# EAGLE design e-208 bms master v2 (EAGLE 6.6.0)
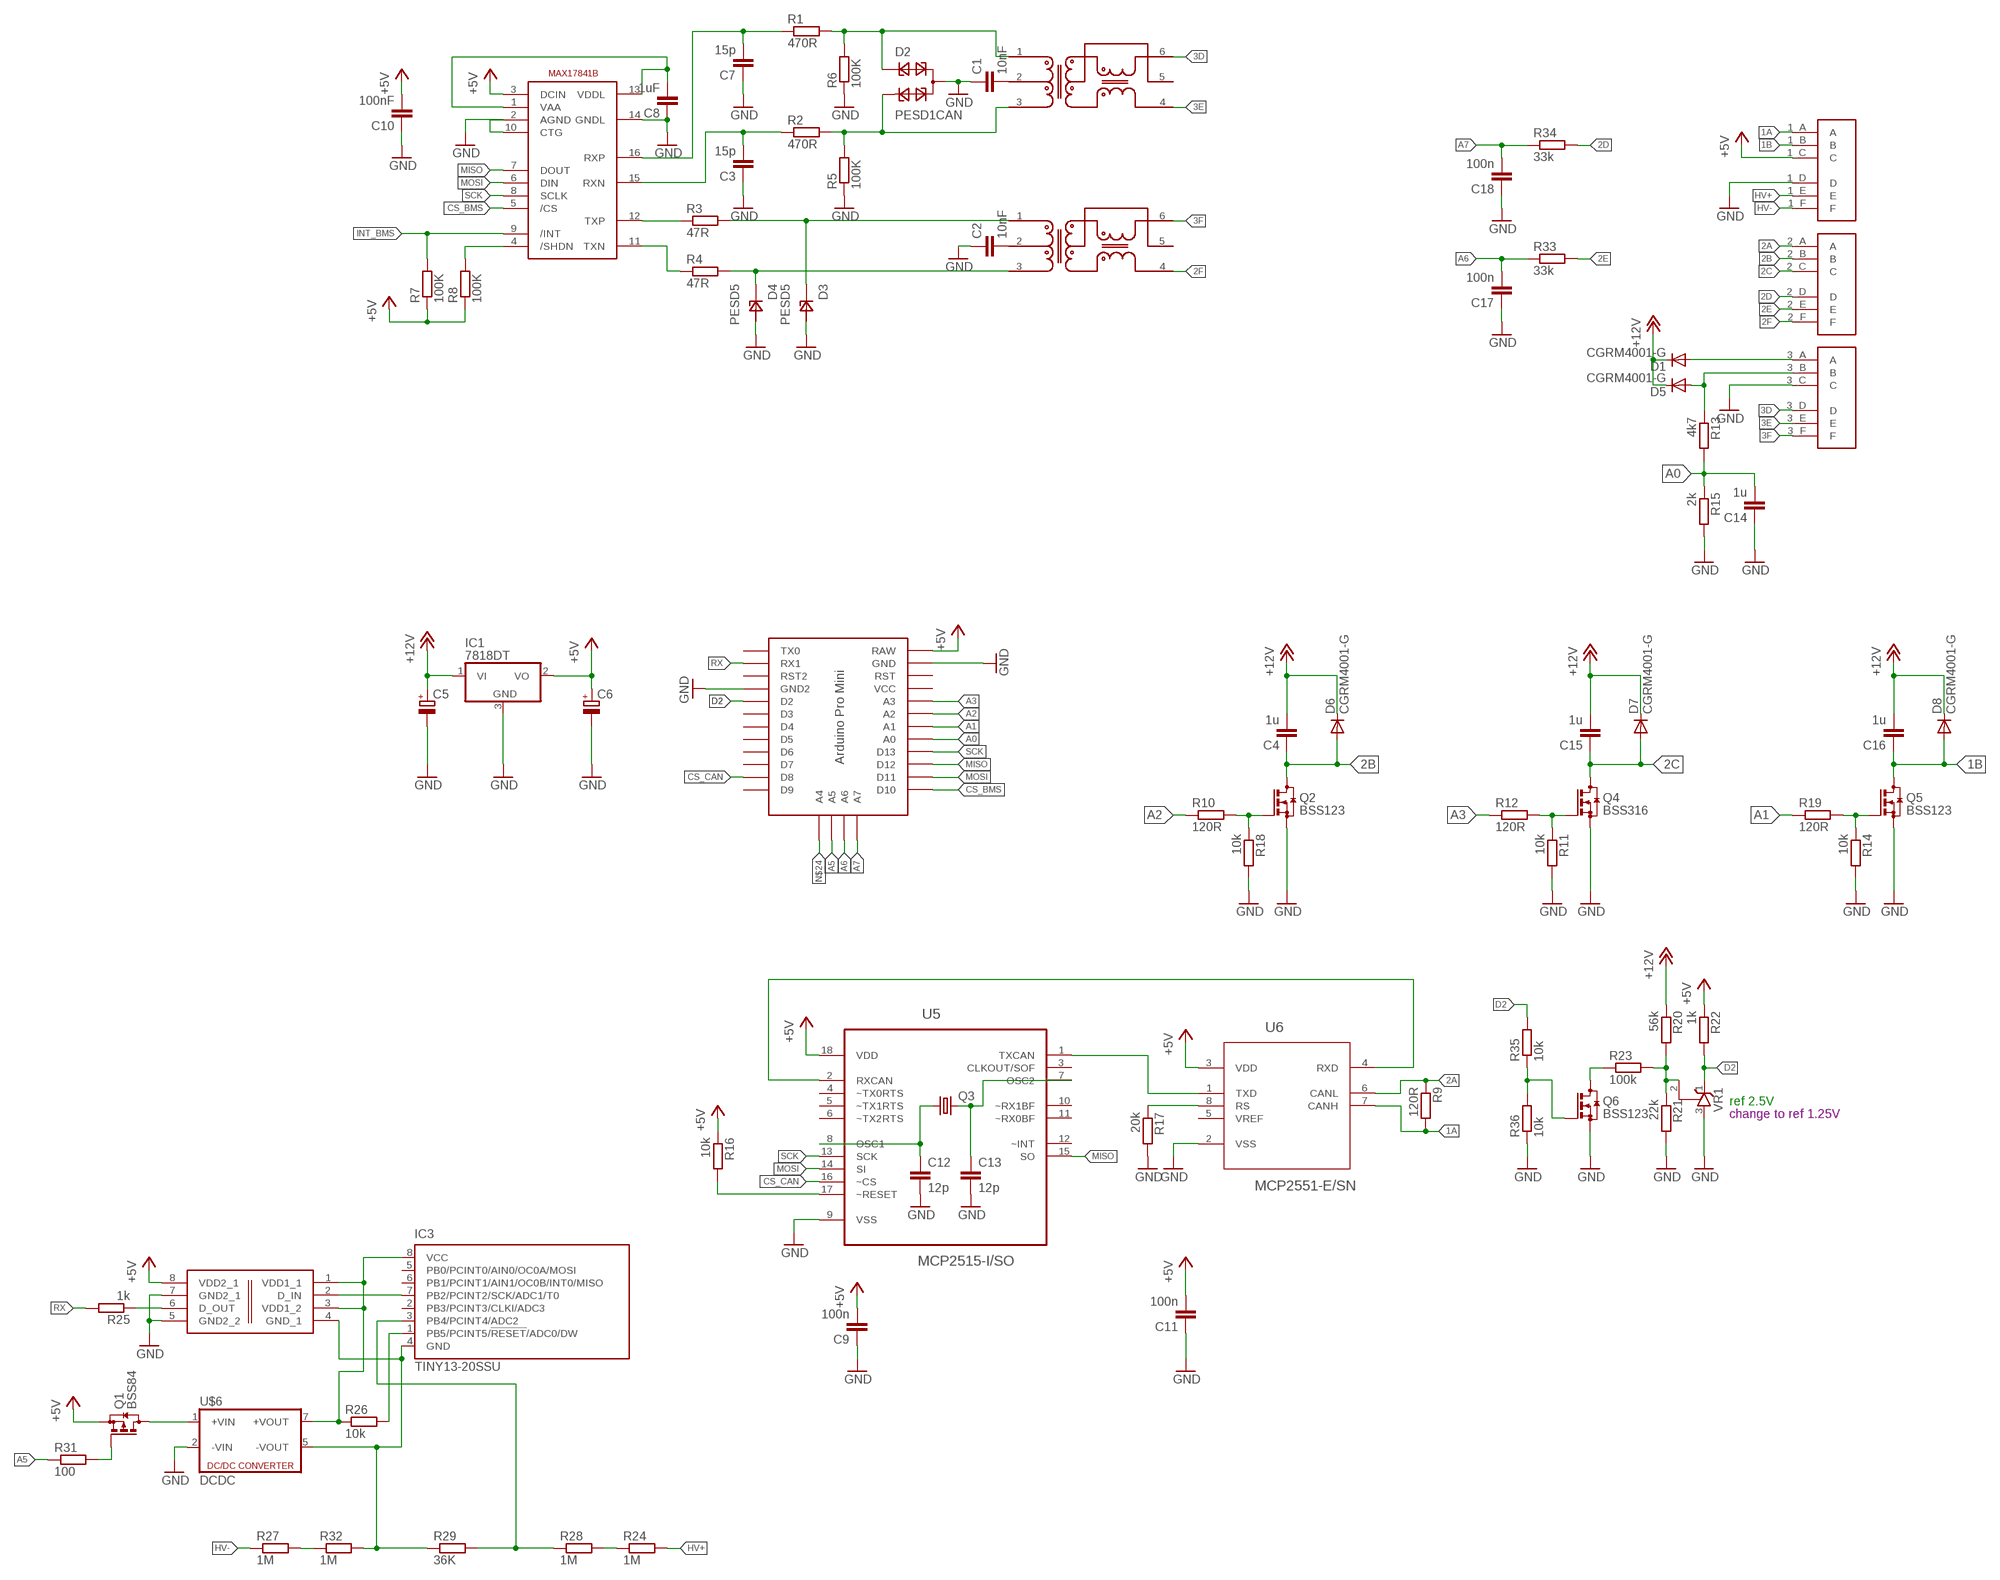
[diagram p0: schematic, sheet 1]

## Parts
C1  10nF  C-EUC0805  [C0805]
C2  10nF  C-EUC0805  [C0805]
C3  15p  C-EUC0805  [C0805]
C4  1u  C-EUC0805  [C0805]
C5  CPOL-EU153CLV-1010  [153CLV-1010]
C6  CPOL-EU153CLV-1010  [153CLV-1010]
C7  15p  C-EUC0805  [C0805]
C8  1uF  C-EUC0805  [C0805]
C9  100n  C-EUC0805  [C0805]
C10  100nF  C-EUC0805  [C0805]
C11  100n  C-EUC0805  [C0805]
C12  12p  C-EUC0603  [C0603]
C13  12p  C-EUC0603  [C0603]
C14  1u  C-EUC0805  [C0805]
C15  1u  C-EUC0805  [C0805]
C16  1u  C-EUC0805  [C0805]
C17  100n  C-EUC0805  [C0805]
C18  100n  C-EUC0805  [C0805]
D1  CGRM4001-G  [SOD-123_MINI-SMA]
D2  PESD1CAN  [SOT23]
D3  PESD5  [SOD323]
D4  PESD5  [SOD323]
D5  CGRM4001-G  [SOD-123_MINI-SMA]
D6  CGRM4001-G  [SOD-123_MINI-SMA]
D7  CGRM4001-G  [SOD-123_MINI-SMA]
D8  CGRM4001-G  [SOD-123_MINI-SMA]
IC1  7818DT  [TO252]
IC3  TINY13-20SSU  [8S1]
Q1  BSS84  [SOT23]
Q2  BSS123  [SOT23]
Q3  CRYSTALHC49U-V  [HC49U-V]
Q4  BSS316  BSS123  [SOT23]
Q5  BSS123  [SOT23]
Q6  BSS123  [SOT23]
R1  470R  R-EU_R0805  [R0805]
R2  470R  R-EU_R0805  [R0805]
R3  47R  R-EU_R0805  [R0805]
R4  47R  R-EU_R0805  [R0805]
R5  100K  R-EU_R0805  [R0805]
R6  100K  R-EU_R0805  [R0805]
R7  100K  R-EU_R0805  [R0805]
R8  100K  R-EU_R0805  [R0805]
R9  120R  R-EU_R0805  [R0805]
R10  120R  R-EU_R0805  [R0805]
R11  10k  R-EU_R0805  [R0805]
R12  120R  R-EU_R0805  [R0805]
R13  4k7  R-EU_R0805  [R0805]
R14  10k  R-EU_R0805  [R0805]
R15  2k  R-EU_R0805  [R0805]
R16  10k  R-EU_R0805  [R0805]
R17  20k  R-EU_R0805  [R0805]
R18  10k  R-EU_R0805  [R0805]
R19  120R  R-EU_R0805  [R0805]
R20  56k  R-EU_R0805  [R0805]
R21  22k  R-EU_R0805  [R0805]
R22  1k  R-EU_R0805  [R0805]
R23  100k  R-EU_R0805  [R0805]
R24  1M  R-EU_R0805  [R0805]
R25  1k  R-EU_R0805  [R0805]
R26  10k  R-EU_R0805  [R0805]
R27  1M  R-EU_R0805  [R0805]
R28  1M  R-EU_R0805  [R0805]
R29  36K  R-EU_R0805  [R0805]
R31  100  R-EU_R0805  [R0805]
R32  1M  R-EU_R0805  [R0805]
R33  33k  R-EU_R0805  [R0805]
R34  33k  R-EU_R0805  [R0805]
R35  10k  R-EU_R0805  [R0805]
R36  10k  R-EU_R0805  [R0805]
U2  MAX17841B  [TSSOP16]
U5  MCP2515-I/SO  [SOIC127P1034X264-18N]
U6  MCP2551-E/SN  [SOIC127P600X175-8N]
U$1  18P_ME  [18P_ME]
U$2  PRO-MINI-3  [PRO-MINI-3]
U$3  SM91502ALE  [SM91502ALE]
U$4  SM91502ALE  [SM91502ALE]
U$5  ADUM110N  [SOIC8]
U$6  DCDC  [DCDC]
VR1  TL431CLPSOT23  [SOT23]

## Nets
1A: R9.2 U6.7(CANH) U$1.1_A(A)
1B: C16.1 D8.A Q5.3(D) U$1.1_B(B)
2A: R9.1 U6.6(CANL) U$1.2_A(A)
2B: C4.1 D6.A Q2.3(D) U$1.2_B(B)
2C: C15.1 D7.A Q4.3(D) U$1.2_C(C)
2D: R34.2 U$1.2_D(D)
2E: R33.2 U$1.2_E(E)
2F: U$1.2_F(F) U$4.4
3D: U$1.3_D(D) U$3.6
3E: U$1.3_E(E) U$3.4
3F: U$1.3_F(F) U$4.6
+5V: C6.+ C9.2 C10.2 C11.2 IC1.2(VO) Q1.2(S) R7.1 R8.1 R16.1 R22.1 U2.3(DCIN) U5.18(VDD) U6.3(VDD) U$1.1_C(C) U$2.RAW U$5.8(VDD2_1)
+12V: C4.2 C5.+ C15.2 C16.2 D1.C D5.C D6.C D7.C D8.C IC1.1(VI) R20.1
A0: C14.2 R13.2 R15.1 U$2.A0
A1: R19.1 U$2.A1
A2: R10.1 U$2.A2
A3: R12.1 U$2.A3
A5: R31.1 U$2.A5
A6: C17.2 R33.1 U$2.A6
A7: C18.2 R34.1 U$2.A7
CS_BMS: U2.5(/CS) U$2.D10
CS_CAN: U5.16(~CS) U$2.D8
D2: R22.2 R35.2 U$2.D2 VR1.1(C)
GND: C1.1 C2.1 C3.1 C5.- C6.- C7.1 C8.1 C9.1 C10.1 C11.1 C12.2 C13.2 C14.1 C17.1 C18.1 D2.3 D3.2 D4.2 IC1.3(GND) Q2.2(S) Q4.2(S) Q5.2(S) Q6.2(S) R5.1 R6.1 R11.2 R14.2 R15.2 R17.2 R18.2 R21.2 R36.1 U2.2(AGND) U2.10(CTG) U2.14(GNDL) U5.9(VSS) U6.2(VSS) U$1.1_D(D) U$1.3_C(C) U$2.GND U$2.GND1(GND2) U$5.5(GND2_2) U$5.7(GND2_1) U$6.2(-VIN) VR1.3(A)
HV+: R24.2 U$1.1_E(E)
HV-: R27.1 U$1.1_F(F)
INT_BMS: R7.2 U2.9(/INT)
MISO: U2.7(DOUT) U5.15(SO) U$2.D12
MOSI: U2.6(DIN) U5.14(SI) U$2.D11
N$1: D4.1 R4.2 U$4.3
N$2: Q2.1(G) R10.2 R18.1
N$3: R20.2 R21.1 R23.2 VR1.2(R)
N$4: D3.1 R3.2 U$4.1
N$5: Q6.3(D) R23.1
N$6: D1.A U$1.3_A(A)
N$7: C2.2 U$4.2
N$8: C1.2 U$3.2
N$9: R4.1 U2.11(TXN)
N$10: IC3.4(GND) R29.1 R32.2 U$5.4(GND_1) U$6.5(-VOUT)
N$11: Q4.1(G) R11.1 R12.2
N$12: R3.1 U2.12(TXP)
N$13: Q5.1(G) R14.1 R19.2
N$14: C3.2 R2.1 U2.15(RXN)
N$15: C7.2 R1.1 U2.16(RXP)
N$16: D2.1 R1.2 R6.2 U$3.1
N$17: D2.2 R2.2 R5.2 U$3.3
N$18: R8.2 U2.4(/SHDN)
N$19: C8.2 U2.1(VAA) U2.13(VDDL)
N$20: U5.1(TXCAN) U6.1(TXD)
N$21: U5.2(RXCAN) U6.4(RXD)
N$22: C12.1 Q3.1 U5.8(OSC1)
N$23: C13.1 Q3.2 U5.7(OSC2)
N$24: U$2.A4
N$25: D5.A R13.1 U$1.3_B(B)
N$26: R16.2 U5.17(~RESET)
N$27: R17.1 U6.8(RS)
N$28: Q6.1(G) R35.1 R36.2
N$29: Q1.3(D) U$6.1(+VIN)
N$30: IC3.7(PB2/PCINT2/SCK/ADC1/T0) U$5.2(D_IN)
N$31: R27.2 R32.1
N$32: R24.1 R28.2
N$33: R25.1 U$5.6(D_OUT)
N$35: IC3.1(PB5/PCINT5/!RESET!/ADC0/DW) R26.2
N$36: IC3.8(VCC) R26.1 U$5.1(VDD1_1) U$5.3(VDD1_2) U$6.7(+VOUT)
N$37: Q1.1(G) R31.2
N$38: IC3.3(PB4/PCINT4/ADC2) R28.1 R29.2
RX: R25.2 U$2.RX1
SCK: U2.8(SCLK) U5.13(SCK) U$2.D13
Unconnected: IC3.2(PB3/PCINT3/CLKI/ADC3) IC3.5(PB0/PCINT0/AIN0/OC0A/MOSI) IC3.6(PB1/PCINT1/AIN1/OC0B/INT0/MISO) U5.3(CLKOUT/SOF) U5.4(~TX0RTS) U5.5(~TX1RTS) U5.6(~TX2RTS) U5.10(~RX1BF) U5.11(~RX0BF) U5.12(~INT) U6.5(VREF) U$2.D3 U$2.D4 U$2.D5 U$2.D6 U$2.D7 U$2.D9 U$2.RST U$2.RST1(RST2) U$2.TX0 U$2.VCC U$3.5 U$4.5

## Notes on the sheet
- ref 2.5V
- change to ref 1.25V

## Library data of the parts
C1-C4 C7-C18 = rcl:C-EU: CAPACITOR, European symbol
C5 C6 = rcl:CPOL-EU: POLARIZED CAPACITOR, European symbol
D1 D5-D8 = diode:CGRM400*-G: Molded plasitc,JEDEC SOD-123/Mini SMA Source: Comchip CGRM4001-G.pdf
D2 = diode:PESD1CAN: CAN bus ESD protection diode Source: http://www.nxp.com/documents/data_sheet/PESD1CAN.pdf
D3 D4 = Manfred:PESD5: ESD protection diode
IC1 = linear:78*: Positive VOLTAGE REGULATOR Source: http://cache.national.com/ds/LM/LM78L05.pdf http://www.fairchildsemi.com/ds/LM/LM7805.pdf
IC3 = atmel:TINY13: 8-bit AVR Microcontroller with 1K Bytes In-System Programmable Flash Source: http://www.atmel.com/dyn/resources/prod_documents/2535S.pdf; MPN: ATTINY13-20SSU; OC_FARNELL: 1455133; OC_NEWARK: 58M3771
Q1 = transistor-small-signal:BSS84: P-CHANNEL MOS FET
Q2 Q4-Q6 = transistor-small-signal:BSS123: N-CHANNEL MOS FET
Q3 = crystal:CRYSTAL: CRYSTAL; OC_FARNELL: 1666969; OC_NEWARK: unknown
R1-R29 R31-R36 = rcl:R-EU_: RESISTOR, European symbol
U2 = Manfred:MAX17841B
U5 = Microchip_By_element14_Batch_1:MCP2515-I/SO: CAN Controller; MPN: MCP2515-I/SO; OC_FARNELL: 1292239; OC_NEWARK: 29H7136; PACKAGE: SOIC-18; SUPPLIER: Microchip
U6 = Microchip_By_element14_Batch_1:MCP2551-E/SN: High-Speed CAN Transceiver; DESCRIPTION: High-Speed CAN Transceiver; MPN: MCP2551-E/SN; OC_FARNELL: 1467746; OC_NEWARK: 92C4186; PACKAGE: SOIC-8; SUPPLIER: Microchip
U$1 = Cinch Connectivity:18P_ME
U$2 = Arduino-clone:PRO-MINI-3
U$3 U$4 = Manfred:SM91502ALE
U$5 = Manfred:ADUM110N
U$6 = Manfred:DCDC
VR1 = v-reg:TL431CLP: VOLTAGE REGULATOR

## Board
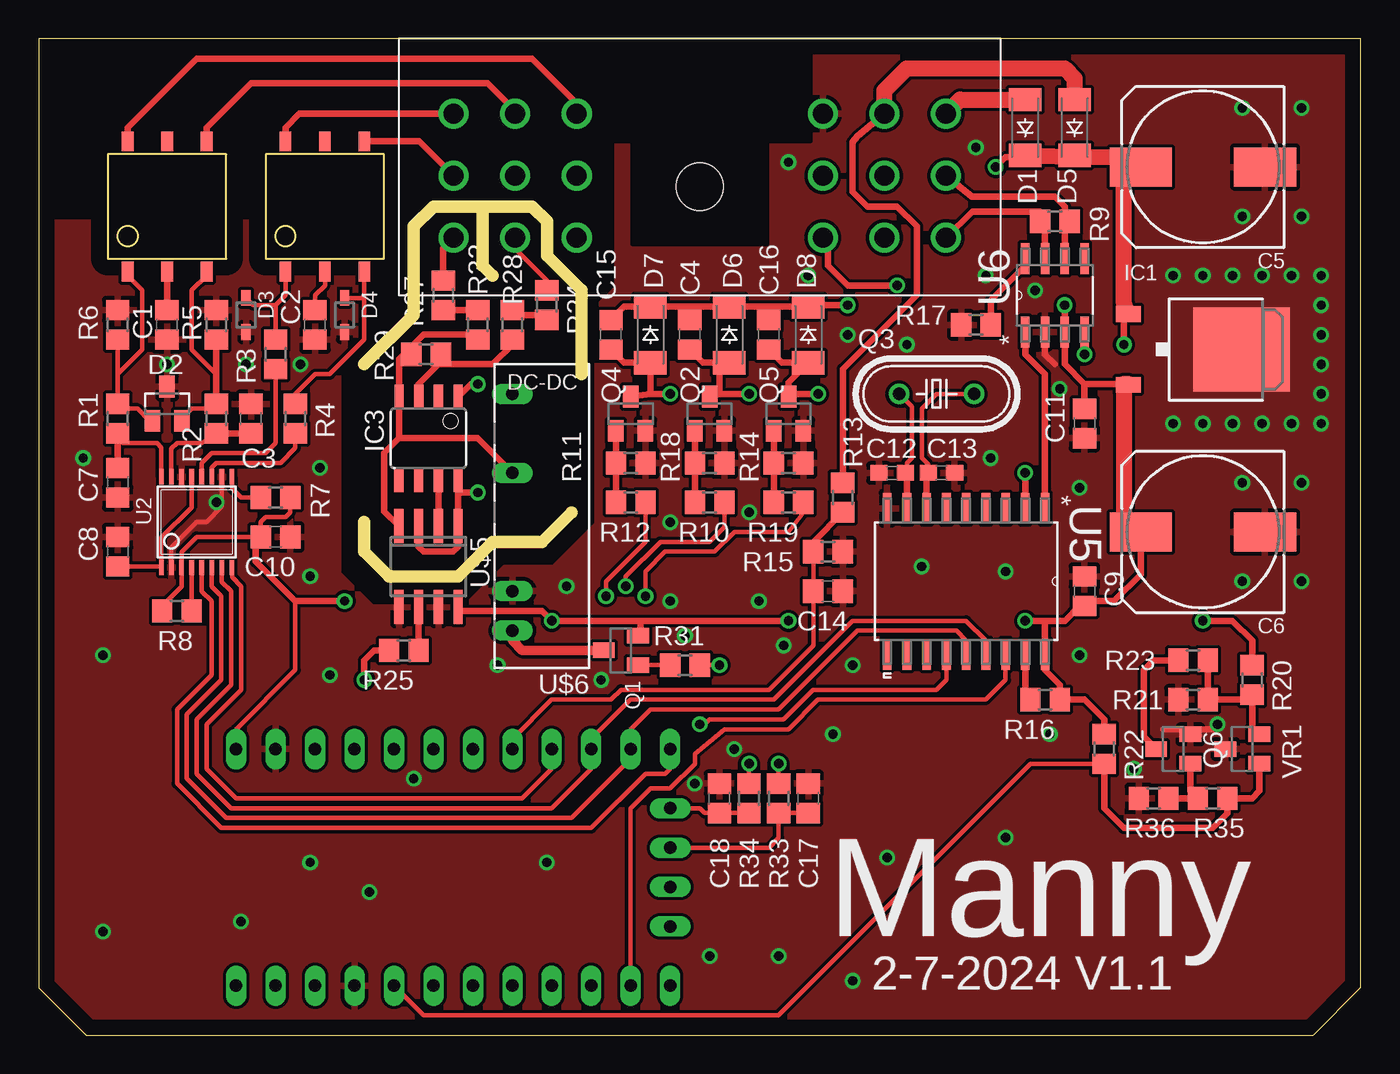
[diagram p1: board, top side]
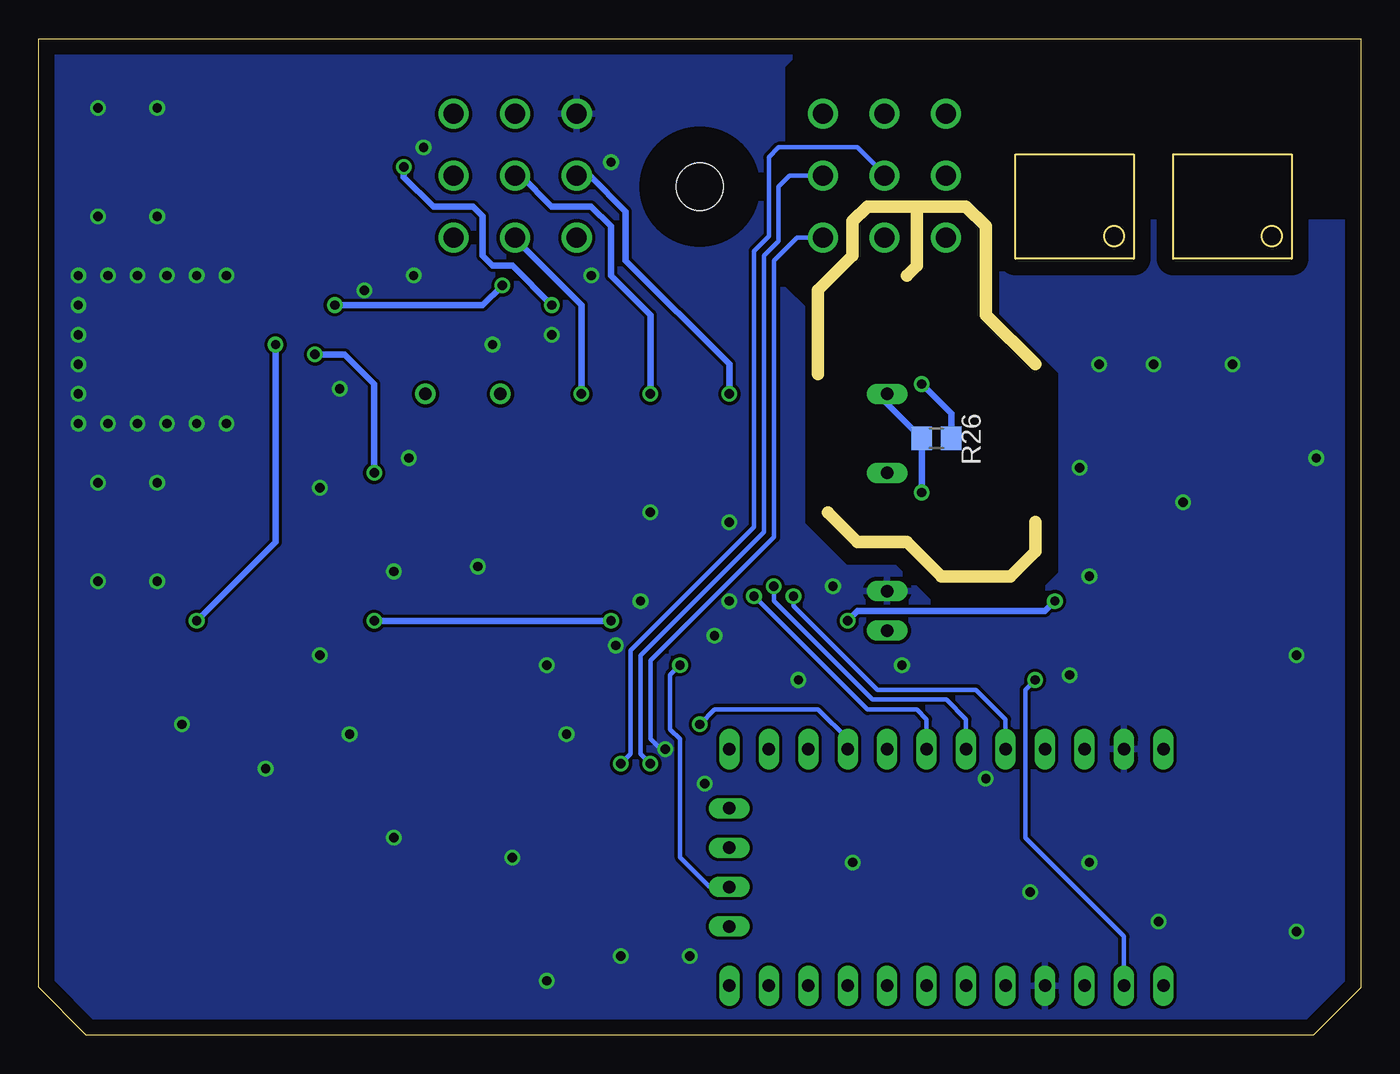
[diagram p2: board, bottom side, seen from below]

Size 85.09 x 64.13 mm. Coordinates in mm from the lower left corner, seen from the top.
Outline: 0,64.13 0,3.05 3.05,0 82.03,0 85.09,3.06 85.09,64.13 0,64.13
Copper layers (1*16): Top 0.035mm / dielectric 1.5mm / Bottom 0.035mm
Design rules "default *": minimum track width 10mil, minimum drill 24mil, track to track 8mil, track to pad 8mil, pad to pad 8mil, via to via 8mil, smd to smd 8mil, copper to edge 40mil, drill to drill 8mil, minimum pad ring 10mil, minimum via ring 8mil, stop-mask expansion 4mil, vias tented up to drill 25mil, thermal gap 10mil
tRestrict: area 38.2,50.9 to 46.9,64.1; area 35.4,57.5 to 49.7,64.1; area 19.7,27.9 to 36.8,54; area -0.6,52.7 to 36.8,64.8
bRestrict: area 38.7,50.7 to 46.4,58.5; area 19.7,27.9 to 36.8,54; area -0.6,52.7 to 36.8,64.8; 4 lines
Milling: 17 lines

### Footprints (pad centres in the part's own frame; a part is rotated, then mirrored left to right if it is on the bottom)
C0805 = smd 1.3 x 1.5: 1 -0.95,0; 2 0.95,0
153CLV-1010 = smd 4 x 2.5: + 4,0; - -4,0
C0603 = smd 1.1 x 1: 1 -0.85,0; 2 0.85,0
SOD-123_MINI-SMA = smd 1.5 x 2.1: A 1.8,0; C -1.8,0
SOT23 = smd 1 x 1.4: 1 -0.95,-1.1; 2 0.95,-1.1; 3 0,1.1
SOD323 = smd 1 x 0.6: 1 -1.1,0; 2 1.1,0
TO252 = smd 1 x 1.6: 1 -2.28,-4.8; 2 2.28,-4.8 | smd 5.4 x 6.2: 3 0,2.5
8S1 = smd 0.6 x 1.6: 1 -1.905,-2.654; 2 -0.645,-2.654; 3 0.625,-2.654; 4 1.895,-2.654; 5 1.905,2.654; 6 0.635,2.654; 7 -0.635,2.654; 8 -1.905,2.654
HC49U-V = drill 0.813: 1 -2.413,0; 2 2.413,0
R0805 = smd 1.3 x 1.5: 1 -0.95,0; 2 0.95,0
TSSOP16 = smd 0.305 x 0.991: 1 -2.275,-2.918; 2 -1.625,-2.918; 3 -0.975,-2.918; 4 -0.325,-2.918; 5 0.325,-2.918; 6 0.975,-2.918; 7 1.625,-2.918; 8 2.275,-2.918; 9 2.275,2.918; 10 1.625,2.918; 11 0.975,2.918; 12 0.325,2.918; 13 -0.325,2.918; 14 -0.975,2.918; 15 -1.625,2.918; 16 -2.275,2.918
SOIC127P1034X264-18N = smd 1.981 x 0.559: 1 -4.699,5.08; 2 -4.699,3.81; 3 -4.699,2.54; 4 -4.699,1.27; 5 -4.699,0; 6 -4.699,-1.27; 7 -4.699,-2.54; 8 -4.699,-3.81; 9 -4.699,-5.08; 10 4.699,-5.08; 11 4.699,-3.81; 12 4.699,-2.54; 13 4.699,-1.27; 14 4.699,0; 15 4.699,1.27; 16 4.699,2.54; 17 4.699,3.81; 18 4.699,5.08
SOIC127P600X175-8N = smd 1.981 x 0.559: 1 -2.362,1.905; 2 -2.362,0.635; 3 -2.362,-0.635; 4 -2.362,-1.905; 5 2.362,-1.905; 6 2.362,-0.635; 7 2.362,0.635; 8 2.362,1.905
18P_ME = drill 1.3: 1_A 15.85,-3.277; 1_B 11.887,-3.277; 1_C 7.925,-3.277; 1_D -7.925,-3.277; 1_E -11.887,-3.277; 1_F -15.85,-3.277; 2_A 15.85,0.711; 2_B 11.887,0.711; 2_C 7.925,0.711; 2_D -7.925,0.711; 2_E -11.887,0.711; 2_F -15.85,0.711; 3_A 15.85,4.699; 3_B 11.887,4.699; 3_C 7.925,4.699; 3_D -7.925,4.699; 3_E -11.887,4.699; 3_F -15.85,4.699 | hole 3.048: 0,0
PRO-MINI-3 = drill 0.8 long: A0 7.62,-5.08; A1 7.62,-2.54; A2 7.62,0; A3 7.62,2.54; A4 -3.81,-15.24; A5 -1.27,-15.24; A6 1.27,-15.24; A7 3.81,-15.24; D2 -7.62,2.54; D3 -7.62,0; D4 -7.62,-2.54; D5 -7.62,-5.08; D6 -7.62,-7.62; D7 -7.62,-10.16; D8 -7.62,-12.7; D9 -7.62,-15.24; D10 7.62,-15.24; D11 7.62,-12.7; D12 7.62,-10.16; D13 7.62,-7.62; GND 7.62,10.16; GND1 -7.62,5.08; RAW 7.62,12.7; RST 7.62,7.62; RST1 -7.62,7.62; RX1 -7.62,10.16; TX0 -7.62,12.7; VCC 7.62,5.08
SM91502ALE = smd 0.762 x 1.27: 1 -2.54,-4.191; 2 0,-4.191; 3 2.54,-4.191; 4 2.54,4.191; 5 0,4.191; 6 -2.54,4.191
SOIC8 = smd 0.6 x 2.2: 1 -1.905,-2.6; 2 -0.635,-2.6; 3 0.635,-2.6; 4 1.905,-2.6; 5 1.905,2.6; 6 0.635,2.6; 7 -0.635,2.6; 8 -1.905,2.6
DCDC = drill 0.813 long: 1 1.27,7.62; 2 1.27,5.08; 5 1.27,-2.54; 7 1.27,-7.62

### Placement (x,y rotation side)
C1  8.26,45.72 90 top
C2  17.78,45.72 90 top
C3  13.65,39.69 270 top
C4  41.91,45.09 90 top
C5  74.93,55.88 180 top
C6  74.93,32.38 180 top
C7  5.08,35.56 90 top
C8  5.08,31.12 270 top
C9  67.31,28.57 270 top
C10  15.24,32.07 180 top
C11  67.31,39.37 90 top
C12  54.93,36.2 180 top
C13  58.1,36.2 0 top
C14  50.8,28.57 180 top
C15  36.83,45.09 90 top
C16  46.99,45.09 90 top
C17  49.53,15.24 270 top
C18  43.81,15.24 270 top
D1  63.5,58.42 90 top
D2  8.26,40.64 0 top
D3  13.34,46.35 270 top
D4  19.68,46.35 270 top
D5  66.67,58.42 90 top
D6  44.45,45.09 270 top
D7  39.37,45.09 270 top
D8  49.53,45.09 270 top
IC1  74.93,44.13 270 top
IC3  25.08,38.42 180 top
Q1  37.47,24.77 90 top
Q2  43.18,40.01 0 top
Q3  57.78,41.27 0 top
Q4  38.1,40.01 0 top
Q5  48.26,40.01 0 top
Q6  73.03,18.41 90 top
R1  5.08,39.69 90 top
R2  11.43,39.69 90 top
R3  15.24,43.82 90 top
R4  16.51,39.69 90 top
R5  11.43,45.72 270 top
R6  5.08,45.72 270 top
R7  15.24,34.61 180 top
R8  8.89,27.3 0 top
R9  65.41,52.39 180 top
R10  43.18,34.29 180 top
R11  38.1,36.83 0 top
R12  38.1,34.29 180 top
R13  51.75,34.61 270 top
R14  48.26,36.83 0 top
R15  50.8,31.12 0 top
R16  64.77,21.59 180 top
R17  60.33,45.72 180 top
R18  43.18,36.83 0 top
R19  48.26,34.29 180 top
R20  78.11,22.86 270 top
R21  74.3,21.59 180 top
R22  68.58,18.41 270 top
R23  74.3,24.13 0 top
R24  32.7,46.99 90 top
R25  23.5,24.77 180 top
R26  27.3,38.42 0 bottom
R27  26.04,47.63 270 top
R28  30.48,45.72 90 top
R29  24.92,43.82 0 top
R31  41.59,23.81 180 top
R32  28.26,45.72 270 top
R33  47.62,15.24 90 top
R34  45.72,15.24 90 top
R35  75.56,15.24 0 top
R36  71.75,15.24 0 top
U2  10.16,33.02 0 top
U5  59.69,29.21 270 top
U6  65.41,47.63 90 top
U$1  42.55,54.61 0 top
U$2  25.4,10.8 90 top
U$3  8.26,53.34 0 top
U$4  18.41,53.34 0 top
U$5  25.08,30.16 180 top
U$6  31.75,33.66 180 top
VR1  77.47,18.41 90 top

### Tracks (layer width: path | path; a pad name or v marks a point on that pad's centre or on a via)
1A
  Top 0.406: U6.7 64.77,52.39 R9.2 64.45,53.02 64.14,53.02 60.08,53.02 U$1.1_A
1B  (via drill 0.6)
  Top 0.406: C16.1 47.84,43.29 D8.A 48.26,42.02 Q5.3 48.43,41.27 v50.16,41.27
  Bottom 0.406: U$1.1_B 54.51,51.33 50.16,46.99 v50.16,41.27
2A
  Top 0.406: U6.6 66.04,52.39 R9.1 | R9.1 66.67,52.71 | R9.1 66.04,52.71 66.04,53.34 65.41,53.98 60.06,53.98 U$1.2_A
2B  (via drill 0.6)
  Top 0.406: C4.1 42.76,43.29 D6.A 43.81,42.65 43.81,41.27 | Q2.3 43.81,41.27 | v45.72,41.27 43.81,41.27
  Bottom 0.406: U$1.2_B 54.05,55.32 52.07,53.34 49.53,53.34 48.26,52.07 48.26,48.9 45.72,46.35 v45.72,41.27
2C  (via drill 0.6)
  Top 0.406: v40.64,41.27 39.37,41.27 | 39.37,41.27 Q4.3 | 39.37,41.27 D7.A 37.68,43.29 C15.1
  Bottom 0.406: U$1.2_C 49.61,55.32 47.31,53.02 47.31,49.85 40.64,43.18 v40.64,41.27
2D  (via drill 0.6)
  Top 0.305: v45.72,17.46 R34.2
  Bottom 0.305: U$1.2_D 36.75,55.32 37.47,54.61 37.47,51.12 38.42,50.16 38.42,32.38 46.35,24.45 46.35,18.1 v45.72,17.46
2E  (via drill 0.6)
  Top 0.305: v47.62,17.46 R33.2
  Bottom 0.305: U$1.2_E 30.66,55.42 32.38,57.15 37.47,57.15 38.1,56.52 38.1,51.44 39.05,50.48 39.05,32.7 46.99,24.77 46.99,18.1 v47.62,17.46
2F
  Top 0.406: U$1.2_F 24.49,57.53 U$4.4
3D
  Top 0.406: U$1.3_D 34.62,59.99 31.75,62.87 10.16,62.87 5.71,58.42 U$3.6
3E
  Top 0.406: U$1.3_E 30.66,59.51 28.89,61.28 13.65,61.28 10.79,58.42 U$3.4
3F
  Top 0.406: U$4.6 15.88,58.42 16.76,59.31 U$1.3_F
+5V  (via drill 0.6)
  Top 0.305: R7.1 16.19,33.66 15.88,33.34 14.61,33.34 14.29,33.02 C10.2 10.16,32.07 9.19,31.09 U2.3 9.19,28.87 8.26,27.94 8.26,27.62 R8.1 | U$2.RAW 12.7,19.69 16.51,23.5 16.51,27.94
  Top 0.406: 69.18,32.07 69.5,32.38 | R22.1 68.58,20.32 67.31,21.59 R16.1 65.72,22.55 64.77,23.5 U5.18 64.77,26.67 | C11.2 67.31,41.91 | 67.31,41.91 70.07,41.91 IC1.2 | 67.31,41.91 66.04,43.18 U6.3 v66.04,46.99 | v48.26,26.67 38.73,26.67 | 38.73,26.67 v33.02,26.67 32.38,27.3 27.25,27.3 U$5.8 | v19.68,27.94 16.51,27.94 13.97,30.48 13.97,31.75 C10.2 | Q1.2 38.73,25.88 38.73,26.67 | v63.5,26.67 64.77,26.67 | 64.77,26.67 66.04,26.67 67,27.63 C9.2 67.25,27.69 67.5,27.94 69.22,27.94 70.93,29.66 C6.+ | v55.24,48.26 52.07,48.26 50.8,49.53 50.8,51 U$1.1_C
  Top 1.016: 69.5,32.38 C6.+ 69.85,32.38 69.85,41.91 70.07,41.91 70.13,41.91 IC1.2
  Bottom 0.406: v48.26,26.67 v63.5,26.67 | v66.04,46.99 56.52,46.99 v55.24,48.26 | v33.02,26.67 32.38,27.3 20.32,27.3 v19.68,27.94
+12V  (via drill 0.6)
  Top 0.406: D5.C 67.31,56.62 67.31,56.55 | IC1.1 69.85,46.45 v69.85,44.45 | R20.1 78.11,25.4 76.83,26.67 v74.93,26.67 | C15.2 37.68,46.88 D7.C 41.91,46.88 | 46.99,46.88 D8.C 49.63,46.99 v52.07,46.99 | C16.2 46.99,46.88 | 41.91,46.88 D6.C 46.99,46.88 | C4.2 41.91,46.88 | v61.59,55.88 62.23,56.52 63.4,56.52 D1.C
  Top 1.016: D1.C 67.31,56.55 69.32,56.52 69.85,55.88 | 69.85,55.88 C5.+ | IC1.1 69.85,47.09 69.85,55.88
  Bottom 0.406: v69.85,44.45 69.85,31.75 v74.93,26.67 | v52.07,46.99 54.61,49.53 55.88,49.53 56.52,50.16 56.52,52.71 57.15,53.34 59.69,53.34 61.59,55.24 v61.59,55.88
A0
  Top 0.305: 49.85,31.76 R15.1 C14.2 49.85,25.09 46.99,22.23 37.47,22.23 36.83,21.59 33.02,21.59 30.48,19.05 U$2.A0
  Top 0.406: 49.85,31.76 R13.2
A1  (via drill 0.6)
  Top 0.305: v39.05,28.26 39.05,29.85 40.32,31.12 43.5,31.12 44.77,32.38 48.26,32.38 49.21,33.65 R19.1
  Bottom 0.305: U$2.A1 27.94,20.32 28.57,20.96 31.75,20.96 v39.05,28.26
A2  (via drill 0.6)
  Top 0.305: v37.78,28.89 37.78,29.53 40.01,31.75 43.18,31.75 44.13,32.71 R10.1
  Top 0.406: R10.1
  Bottom 0.305: U$2.A2 25.4,20.32 26.67,21.59 31.43,21.59 37.78,27.94 v37.78,28.89
A3  (via drill 0.6)
  Top 0.305: v36.51,28.26 36.51,29.21 37.47,30.16 39.05,31.75 R12.1
  Top 0.406: R12.1
  Bottom 0.305: U$2.A3 22.86,20.32 24.77,22.23 31.11,22.23 36.51,27.62 v36.51,28.26
A5  (via drill 0.6)
  Top 0.305: v43.81,23.81 R31.1
  Bottom 0.305: U$2.A5 41.91,9.53 43.81,11.43 43.81,19.05 44.45,19.69 44.45,23.18 v43.81,23.81
A6
  Top 0.305: U$2.A6 46.99,12.07 47.62,12.7 R33.1 C17.2
A7
  Top 0.305: R34.1 C18.2 42.86,14.29 42.55,14.61 U$2.A7
CS_BMS
  Top 0.305: U2.5 10.48,28.57 11.11,27.94 11.11,23.18 8.89,20.96 8.89,16.19 11.75,13.34 35.56,13.34 39.05,16.83 40.32,16.83 40.64,17.15 U$2.D10
CS_CAN
  Top 0.305: U$2.D8 38.1,14.61 39.37,15.88 40.64,15.88 42.23,17.46 42.23,18.1 44.13,19.69 48.26,19.69 50.16,21.59 60.96,21.59 62.23,22.86 U5.16
D2
  Top 0.305: U$2.D2 24.77,1.27 47.62,1.27 63.82,17.47 R22.2
  Top 0.406: VR1.1 78.57,15.71 78.11,15.24 R35.2 76.52,14.29 75.56,13.34 69.85,13.34 68.58,14.61 R22.2
GND  (via drill 0.6)
  Top 0.305: U2.2 8.54,31.4 10.16,33.02 10.79,33.02 11.79,34.01 U2.10
  Top 0.406: U6.2 64.77,43.82 65.41,43.18 | Q6.2 73.81,19.69 | 73.81,19.69 72.39,19.69 | 73.81,19.69 75.56,19.69
  Bottom 0.305: U$1.1_D 36.3,51.33 37.78,49.85 37.78,32.07 45.72,24.13 45.72,19.05 45.09,18.41
  other vias: 16.83,43.18 11.43,34.29 13.34,43.18 8.26,43.18 64.14,47.94 60.96,48.9 77.47,52.71 81.28,52.71 81.28,59.69 77.47,59.69 77.47,35.56 81.28,35.56 77.47,29.21 81.28,29.21 75.88,20 65.09,19.37 45.72,33.66 40.64,27.94 52.39,23.81 51.12,19.37 42.23,16.19 46.35,27.94 40.64,33.02 18.73,23.18 65.72,41.59 55.88,44.45 62.23,29.85 74.93,48.9 76.83,48.9 78.74,48.9 80.64,48.9 82.55,48.9 82.55,46.99 82.55,45.09 82.55,43.18 82.55,41.27 82.55,39.37 80.64,39.37 78.74,39.37 76.83,39.37 74.93,39.37 73.03,39.37 73.03,48.9 66.99,24.45 56.83,30.16 70.48,17.15 36.2,22.86 47.94,25.08 32.7,11.11 4.13,6.67 4.13,24.45 17.46,29.53 18.1,36.51 2.86,37.15 61.28,37.15 66.99,35.24 52.39,3.49 47.62,5.08 43.18,5.08 54.61,11.43 62.23,12.7 48.26,56.2 49.53,48.9 60.33,57.15 21.27,9.21 17.46,11.11 13.02,7.3 29.53,23.81 24.13,16.51 44.77,18.41 41.59,25.72 52.07,45.09 33.97,28.89
  pour Top (rank 3): -3.81,67.31 90.17,67.31 90.17,-2.54 -3.81,-2.54
  pour Bottom: -3.81,67.31 90.17,67.31 90.17,-2.54 -3.81,-2.54
  pour Top (rank 2, no thermals): 83.82,50.16 83.82,38.74 71.75,38.74 71.75,50.16
HV+
  Top 0.305: R24.2 32.7,48.58 30.66,50.62 U$1.1_E
HV-
  Top 0.406: R27.1 26.04,50.67 U$1.1_F
INT_BMS
  Top 0.305: U2.9 12.44,35.19 13.02,34.61 R7.2
MISO
  Top 0.305: U2.7 11.79,29.17 12.38,28.57 12.38,22.54 10.16,20.32 10.16,16.83 12.38,14.61 33.02,14.61 35.56,17.15 U$2.D12 35.56,19.05 38.1,21.59 47.31,21.59 52.39,26.67 59.69,26.67 60.96,25.4 U5.15
MOSI
  Top 0.305: U2.6 11.13,28.87 11.75,28.26 11.75,22.86 9.53,20.64 9.53,16.51 12.06,13.97 34.29,13.97 38.1,17.78 U$2.D11 38.1,19.69 39.37,20.96 47.62,20.96 52.7,26.04 59.05,26.04 59.69,25.4 U5.14
N$1
  Top 0.305: R4.2 16.51,41.27 17.78,42.55 18.73,42.55 20.95,44.77 20.95,47.63 | 20.95,47.63 U$4.3 | D4.1 20.79,47.46 20.95,47.63
N$2
  Top 0.406: R10.2 R18.1 Q2.1
N$3
  Top 0.406: VR1.2 78.11,19.83 R20.2 77.78,21.59 R21.1 R23.2
N$4
  Top 0.305: R3.2 15.24,46.99 | 15.24,46.99 15.88,47.63 U$4.1 | 15.24,46.99 13.8,46.99 D3.1
N$5
  Top 0.406: Q6.3 71.12,19.22 71.12,23.5 71.75,24.13 R23.1
N$6
  Top 1.016: U$1.3_A 59.31,60.22 D1.A
N$7
  Top 0.305: C2.2 17.78,47.63 18.41,48.26 U$4.2
N$8
  Top 0.406: U$3.2 C1.2
N$9
  Top 0.305: U2.11 11.13,36.54 11.43,36.83 15.56,36.83 16.51,37.78 R4.1
N$10
  Top 0.406: R32.2 27.94,45.09 24.77,45.09 24.13,44.45 24.13,43.97 R29.1 23.5,43.82 23.19,43.51 IC3.4 23.19,38.43 | U$5.4 22.23,33.71 22.23,37.46 23.19,38.43 | U$6.5 28.25,38.43 23.19,38.43
N$11
  Top 0.406: R12.2 R11.1 Q4.1
N$12
  Top 0.305: U2.12 10.48,36.84 11.11,37.46 14.61,37.46 15.24,38.1 R3.1
N$13
  Top 0.406: R19.2 R14.1 Q5.1
N$14
  Top 0.305: U2.15 8.54,37.74 8.89,38.1 10.47,38.1 R2.1
  Top 0.406: R2.1 C3.2
N$15
  Top 0.305: U2.16 7.88,37.84 7.62,38.1 5.4,38.1 R1.1
  Top 0.406: C7.2 R1.1
N$16
  Top 0.305: U$3.1 5.71,48.9 6.67,47.94 6.67,44.13 5.08,42.55 | 5.08,42.55 R6.2 | 5.08,42.55 R1.2 5.08,40.32 6.35,40.32 7.13,39.54 D2.1
N$17
  Top 0.305: U$3.3 10.79,48.9 9.84,47.94 9.84,44.13 11.43,42.55 | D2.2 9.21,39.69 9.84,40.32 11.43,40.32 R2.2
  Top 0.406: R5.2 11.43,42.55 R2.2
N$18
  Top 0.305: U2.4 9.84,27.63 R8.2
N$19
  Top 0.305: U2.13 9.84,33.96 7.88,32.02 U2.1 7.82,30.16 C8.2
N$20
  Top 0.406: U5.1 64.77,42.55 63.5,43.82 U6.1
N$21  (via drill 0.6)
  Top 0.406: U5.2 v63.5,36.2 | v67.31,43.82 U6.4
  Bottom 0.406: v63.5,36.2 63.5,41.91 65.41,43.82 v67.31,43.82
N$22
  Top 0.305: 55.88,36.2 55.88,36.83 56.2,37.15 56.2,40.45 Q3.1
  Top 0.406: U5.8 55.88,36.2 C12.1
N$23
  Top 0.305: C13.1 57.25,36.73 56.83,37.15 56.83,40.32 57.78,41.27 Q3.2
  Top 0.406: U5.7 57.15,36.2 C13.1
N$25
  Top 0.305: R13.1
  Top 0.406: U$1.3_B 52.7,57.86 52.39,57.47 52.39,54.29 53.34,53.34 55.24,53.34 56.52,52.07 56.52,47.63 51.75,42.86 51.75,40.96 R13.1
  Top 1.016: U$1.3_B 54.43,60.78 55.88,62.23 66.04,62.23 66.67,61.6 D5.A
N$26
  Top 0.406: U5.17 63.5,21.91 R16.2
N$27
  Top 0.406: U6.8 63.5,49.53 61.28,47.31 R17.1
N$28
  Top 0.406: R36.2 R35.1 74.12,15.73 Q6.1
N$29
  Top 0.61: U$6.1 30.48,25.4 31.11,24.77 Q1.3
N$30
  Top 0.406: IC3.7 U$5.2
N$31
  Top 0.406: R27.2 R32.1
N$32
  Top 0.406: R28.2 30.48,46.35 32.7,46.35 R24.1
N$33
  Top 0.406: U$5.6 R25.1
N$35  (via drill 0.6)
  Top 0.406: IC3.1 27.83,41.91 v28.26,41.91
  Bottom 0.406: v28.26,41.91 26.36,40.01 R26.2
N$36  (via drill 0.6)
  Top 0.406: IC3.8 26.99,34.93 | 26.99,34.93 U$5.1 26.99,31.43 26.67,31.12 24.77,31.12 24.45,31.43 U$5.3 | v28.26,34.93 26.99,34.93
  Bottom 0.406: U$6.7 30.48,40.64 R26.1 v28.26,34.93
N$37
  Top 0.305: Q1.1 R31.2
N$38
  Top 0.406: IC3.3 24.46,41.92 25.72,43.18 | 25.72,43.18 25.72,43.66 R29.2 | R28.1 30.48,44.45 29.21,43.18 25.72,43.18
RX  (via drill 0.6)
  Top 0.406: v20.95,22.86 20.95,24.13 21.59,24.77 R25.2
  Bottom 0.305: U$2.RX1 15.24,6.35 21.59,12.7 21.59,22.23 v20.95,22.86
SCK  (via drill 0.6)
  Top 0.305: U$2.D13 33.02,17.15 31.11,15.24 12.7,15.24 10.79,17.15 10.79,20 13.02,22.23 13.02,28.89 12.44,29.48 U2.8 | v42.55,20 42.86,20 43.18,20.32 47.94,20.32 49.85,22.23 57.78,22.23 58.42,22.86 U5.13
  Bottom 0.305: U$2.D13 33.02,19.05 34.92,20.96 41.59,20.96 v42.55,20

### Text on the board
tNames: Manny | 2-7-2024 V1.1